# Altium project VESC_DEVICE.PrjPcb
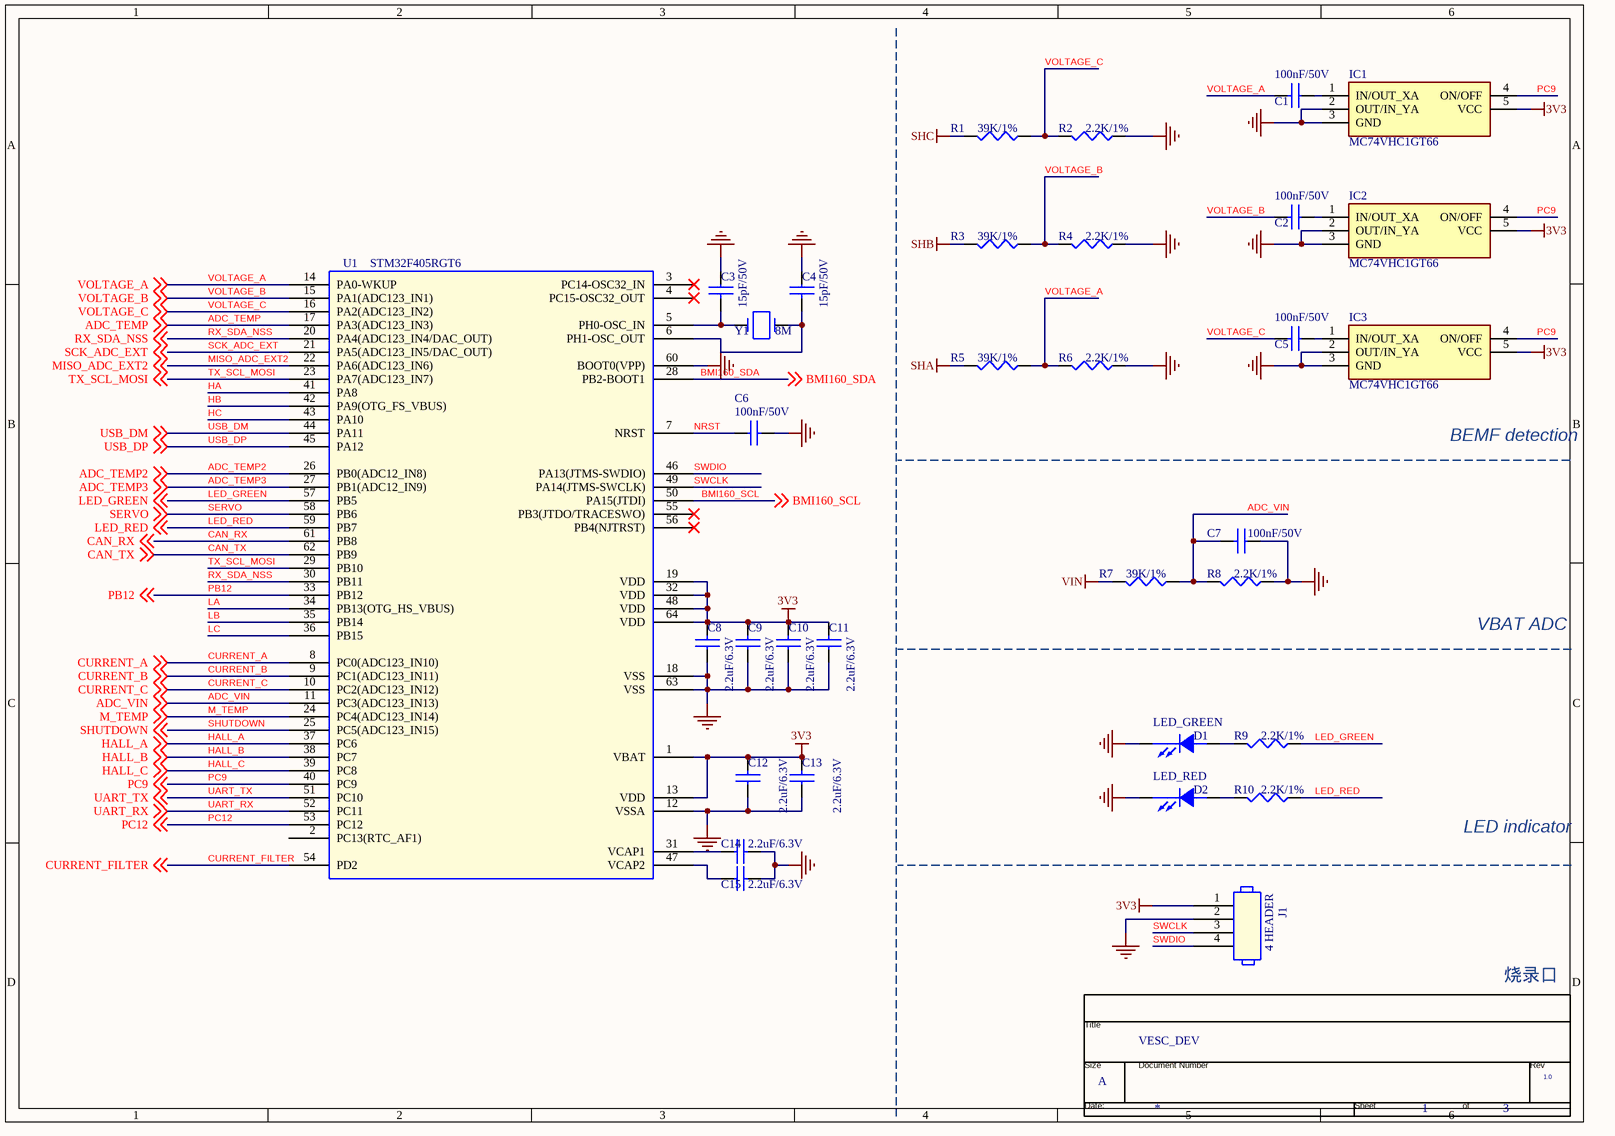
[diagram p0: MCU.SchDoc]
6 sheets, 198 parts. Net scope: global (net labels, ports and power ports of the same name join across sheets).
Board file: VESC_DEVICE.PcbDoc
Sheets:
  MCU.SchDoc
  Power.SchDoc
  BMI160.SchDoc
  NRF51822.SchDoc
  Gate_Drive.SchDoc
  Connector.SchDoc

## Sheet MCU.SchDoc
size 297 x 209 mm

### Parts
(Parts that share a designator on the sheet are numbered #1, #2 ... from top to bottom, then left to right.)
*#1  Page Count: 3  Page Number: 1  Page Size: A  Title: VESC_DEV  RevCode: 1.0  (hidden comment: TitleBlock0)  (graphical)
C1  100nF/50V  [C0402]
C2  100nF/50V  [C0402]
C3  15pF/50V  [C0402]
C4  15pF/50V  [C0402]
C5  100nF/50V  [C0402]
C6  100nF/50V  [C0402]
C7  100nF/50V  [C0402]
C8  2.2uF/6.3V  [C0402]
C9  2.2uF/6.3V  [C0402]
C10  2.2uF/6.3V  [C0402]
C11  2.2uF/6.3V  [C0402]
C12  2.2uF/6.3V  [C0402]
C13  2.2uF/6.3V  [C0402]
C14  2.2uF/6.3V  [C0402]
C15  2.2uF/6.3V  [C0402]
D1  LED_GREEN  [LED0603]
D2  LED_RED  [LED0603]
IC1  MC74VHC1GT66  [SOT95P275X110-5N]
IC2  MC74VHC1GT66  [SOT95P275X110-5N]
IC3  MC74VHC1GT66  [SOT95P275X110-5N]
J1  4 HEADER  [ISP-4P-2_54]
R1  39K/1%  [R0402]
R2  2.2K/1%  [R0402]
R3  39K/1%  [R0402]
R4  2.2K/1%  [R0402]
R5  39K/1%  [R0402]
R6  2.2K/1%  [R0402]
R7  39K/1%  [R0402]
R8  2.2K/1%  [R0402]
R9  2.2K/1%  [R0402]
R10  2.2K/1%  [R0402]
U1  STM32F405RGT6  [LQFP64_10X10_05P]
Y1  8M  [SMD5032-2P]

### Nets
3V3: C8.2 C9.2 C10.2 C11.2 C12.2 C13.2 IC1.5(VCC) IC2.5(VCC) IC3.5(VCC) J1.1 U1.1(VBAT) U1.13(VDD) U1.19(VDD) U1.32(VDD) U1.48(VDD) U1.64(VDD)
GND: C3.1 C4.1 C6.2 C7.1 C8.1 C9.1 C10.1 C11.1 C12.1 C13.1 C14.2 C15.2 D1.1(CATHODE) D2.1(CATHODE) IC1.2(OUT/IN_YA) IC1.3(GND) IC2.2(OUT/IN_YA) IC2.3(GND) IC3.2(OUT/IN_YA) IC3.3(GND) J1.2 R2.1 R4.1 R6.1 R8.1 U1.12(VSSA) U1.18(VSS) U1.60(BOOT0(VPP)) U1.63(VSS)
SHA: R5.2
SHB: R3.2
SHC: R1.2
VIN: R7.2
ADC_TEMP: U1.17(PA3(ADC123_IN3)) ; off-sheet ADC_TEMP
ADC_TEMP2: U1.26(PB0(ADC12_IN8)) ; off-sheet ADC_TEMP2
ADC_TEMP3: U1.27(PB1(ADC12_IN9)) ; off-sheet ADC_TEMP3
ADC_VIN: C7.2 R7.1 R8.2 U1.11(PC3(ADC123_IN13)) ; off-sheet ADC_VIN
BMI160_SCL: U1.50(PA15(JTDI)) ; off-sheet BMI160_SCL
BMI160_SDA: U1.28(PB2-BOOT1) ; off-sheet BMI160_SDA
CAN_RX: U1.61(PB8) ; off-sheet CAN_RX
CAN_TX: U1.62(PB9) ; off-sheet CAN_TX
CURRENT_A: U1.8(PC0(ADC123_IN10)) ; off-sheet CURRENT_A
CURRENT_B: U1.9(PC1(ADC123_IN11)) ; off-sheet CURRENT_B
CURRENT_C: U1.10(PC2(ADC123_IN12)) ; off-sheet CURRENT_C
CURRENT_FILTER: U1.54(PD2) ; off-sheet CURRENT_FILTER
HA: U1.41(PA8)
HALL_A: U1.37(PC6) ; off-sheet HALL_A
HALL_B: U1.38(PC7) ; off-sheet HALL_B
HALL_C: U1.39(PC8) ; off-sheet HALL_C
HB: U1.42(PA9(OTG_FS_VBUS))
HC: U1.43(PA10)
LA: U1.34(PB13(OTG_HS_VBUS))
LB: U1.35(PB14)
LC: U1.36(PB15)
LED_GREEN: R9.1 U1.57(PB5) ; off-sheet LED_GREEN
LED_RED: R10.1 U1.59(PB7) ; off-sheet LED_RED
M_TEMP: U1.24(PC4(ADC123_IN14)) ; off-sheet M_TEMP
MISO_ADC_EXT2: U1.22(PA6(ADC123_IN6)) ; off-sheet MISO_ADC_EXT2
NRST: C6.1 U1.7(NRST)
PB12: U1.33(PB12) ; off-sheet PB12
PC9: IC1.4(ON/OFF) IC2.4(ON/OFF) IC3.4(ON/OFF) U1.40(PC9) ; off-sheet PC9
PC12: U1.53(PC12) ; off-sheet PC12
RX_SDA_NSS: U1.20(PA4(ADC123_IN4/DAC_OUT)) U1.30(PB11) ; off-sheet RX_SDA_NSS
SCK_ADC_EXT: U1.21(PA5(ADC123_IN5/DAC_OUT)) ; off-sheet SCK_ADC_EXT
SERVO: U1.58(PB6) ; off-sheet SERVO
SHUTDOWN: U1.25(PC5(ADC123_IN15)) ; off-sheet SHUTDOWN
SWCLK: J1.3 U1.49(PA14(JTMS-SWCLK))
SWDIO: J1.4 U1.46(PA13(JTMS-SWDIO))
TX_SCL_MOSI: U1.23(PA7(ADC123_IN7)) U1.29(PB10) ; off-sheet TX_SCL_MOSI
UART_RX: U1.52(PC11) ; off-sheet UART_RX
UART_TX: U1.51(PC10) ; off-sheet UART_TX
USB_DM: U1.44(PA11) ; off-sheet USB_DM
USB_DP: U1.45(PA12) ; off-sheet USB_DP
VOLTAGE_A: C1.2 R5.1 R6.2 U1.14(PA0-WKUP) ; off-sheet VOLTAGE_A
VOLTAGE_B: C2.2 R3.1 R4.2 U1.15(PA1(ADC123_IN1)) ; off-sheet VOLTAGE_B
VOLTAGE_C: C5.2 R1.1 R2.2 U1.16(PA2(ADC123_IN2)) ; off-sheet VOLTAGE_C
NetC1_1: C1.1 IC1.1(IN/OUT_XA)
NetC2_1: C2.1 IC2.1(IN/OUT_XA)
NetC3_2: C3.2 U1.5(PH0-OSC_IN) Y1.2
NetC4_2: C4.2 U1.6(PH1-OSC_OUT) Y1.1
NetC5_1: C5.1 IC3.1(IN/OUT_XA)
NetC14_1: C14.1 U1.31(VCAP1)
NetC15_1: C15.1 U1.47(VCAP2)
NetD1_2: D1.2(ANODE) R9.2
NetD2_2: D2.2(ANODE) R10.2

Not connected (* = marked no-connect by the designer): U1 2(PC13(RTC_AF1)) 3(PC14-OSC32_IN)* 4(PC15-OSC32_OUT)* 55(PB3(JTDO/TRACESWO))* 56(PB4(NJTRST))*

### Notes on the sheet
- BEMF detection
- VBAT ADC
- LED indicator
- 烧录口
- (in symbol TitleBlock0) Title; Size; Document Number; Rev; Date:; Sheet; of

### Library data of the parts
C1-C15 = CAP NP: PCB Footprint: C0402
D1 D2 = LED: PCB Footprint: LED0603
IC1-IC3 = MC74VHC1GT66: Integrated Circuit; Manufacturer_Name: onsemi; Datasheet Link: https://pdf1.alldatasheet.com/datasheet-pdf/view/148919/ETL/MC74VHC1GT66.html; Height: 1.1mm; Manufacturer_Part_Number: MC74VHC1GT66; Mouser Part Number: N/A; Mouser Price/Stock: https://www.mouser.co.uk/ProductDetail/onsemi/MC74VHC1GT66?qs=YA77FY0Msbu77w80Y0DYXA%3D%3D
R1-R10 = RESISTOR: PCB Footprint: R0402
Y1 = CRYSTAL: PCB Footprint: SMD5032-2P
*#1 = TitleBlock0: Page Create Date: March  8, 1995; Page Modify Date: *
J1 = 4 HEADER: PCB Footprint: ISP-4P-2_54
U1 = STM32F405RGT6: PCB Footprint: LQFP64_10X10_05P

## Sheet Power.SchDoc
size A
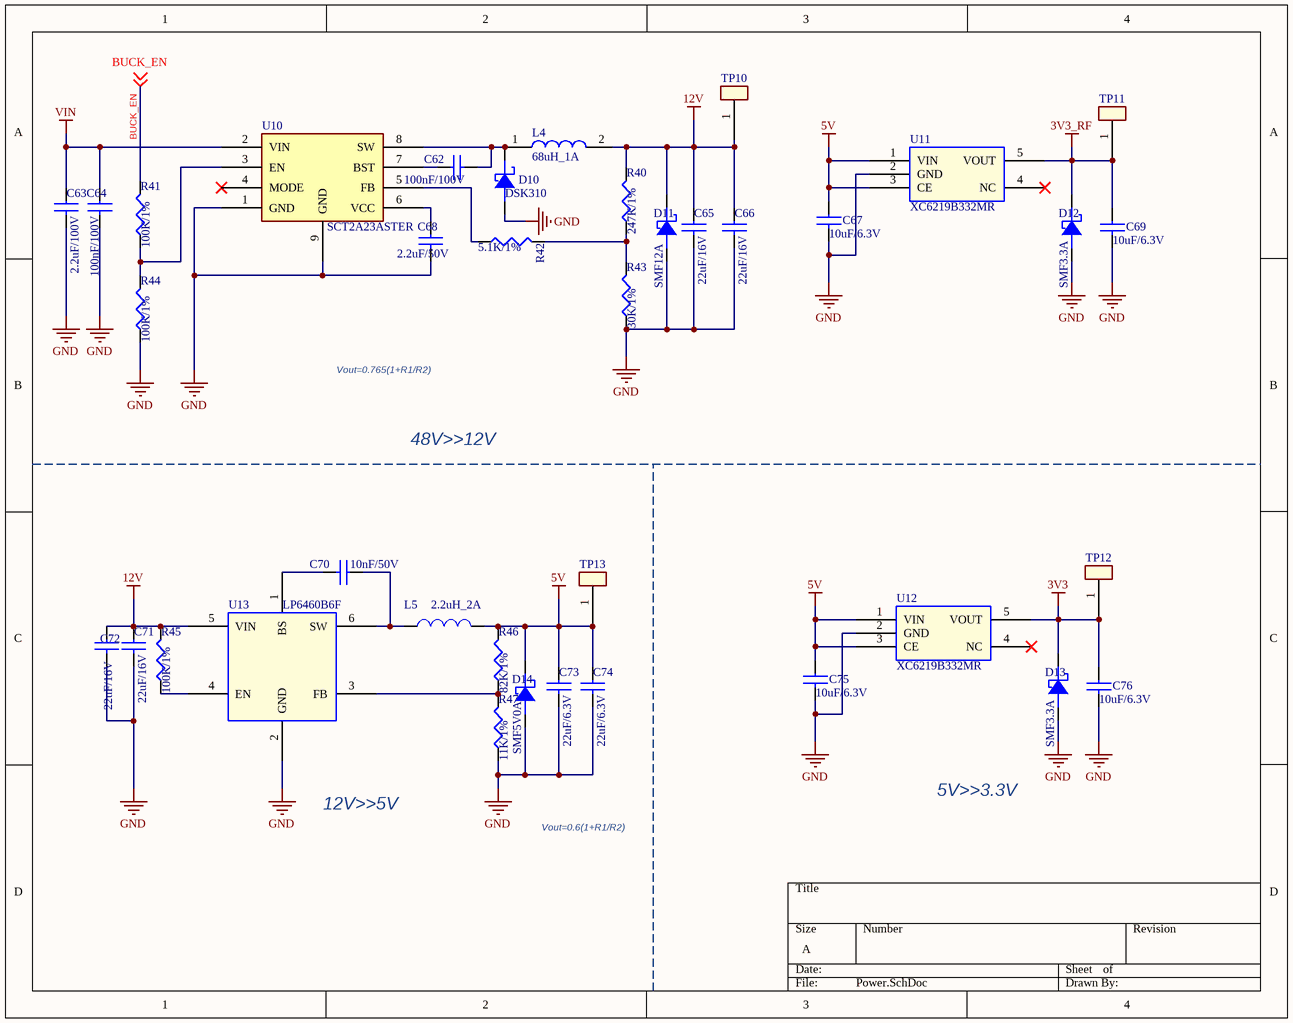
[diagram p1: Power.SchDoc]

### Parts
(Parts that share a designator on the sheet are numbered #1, #2 ... from top to bottom, then left to right.)
C62#1  100nF/100V  [C0603]
C63  2.2uF/100V  [C1206]
C64  100nF/100V  [C0603]
C65  22uF/16V  [C0805]
C66  22uF/16V  [C0805]
C67  10uF/6.3V  [C0402]
C68  2.2uF/50V  [C0603]
C69  10uF/6.3V  [C0402]
C70  10nF/50V  [C0402]
C71  22uF/16V  [C0805]
C72  22uF/16V  [C0805]
C73  22uF/6.3V  [C0805]
C74  22uF/6.3V  [C0805]
C75  10uF/6.3V  [C0402]
C76  10uF/6.3V  [C0402]
D10  DSK310  [SOD-123F]
D11  SMF12A  [SOD-123F]
D12  SMF3.3A  [SOD-123F]
D13  SMF3.3A  [SOD-123F]
D14  SMF5V0A  [SOD-123F]
L4  68uH_1A  [L5040]
L5  2.2uH_2A  [L4020]
R40  247K/1%  [R0402]
R41  100K/1%  [R0402]
R42  5.1K/1%  [R0402]
R43  30K/1%  [R0402]
R44  100K/1%  [R0402]
R45  100K/1%  [R0402]
R46  82K/1%  [R0402]
R47  11K/1%  [R0402]
TP10  TEST POINT  [test_point_100_smd]  (value not drawn)
TP11  TEST POINT  [test_point_100_smd]  (value not drawn)
TP12  TEST POINT  [test_point_100_smd]  (value not drawn)
TP13  TEST POINT  [test_point_100_smd]  (value not drawn)
U10  SCT2A23ASTER  [ESOP-8_L4.9-W3.9-P1.27-LS6.0-BL-EP]
U11  XC6219B332MR  [SOT-23-5]
U12  XC6219B332MR  [SOT-23-5]
U13  LP6460B6F  [SOT-23-6]

### Nets
3V3: C76.1 D13.1(K) TP12.1 U12.5(VOUT)
3V3_RF: C69.1 D12.1(K) TP11.1 U11.5(VOUT)
5V: C67.1 C73.1 C74.1 C75.1 D14.1(K) L5.2 R46.2 TP13.1 U11.1(VIN) U11.3(CE) U12.1(VIN) U12.3(CE)
12V: C65.1 C66.1 C71.1 C72.1 D11.1(K) L4.2 R40.2 R45.2 TP10.1 U13.5(VIN)
GND: C63.2 C64.2 C65.2 C66.2 C67.2 C68.2 C69.2 C71.2 C72.2 C73.2 C74.2 C75.2 C76.2 D10.2(A) D11.2(A) D12.2(A) D13.2(A) D14.2(A) R43.1 R44.1 R47.1 U10.1(GND) U10.9(GND) U11.2(GND) U12.2(GND) U13.2(GND)
VIN: C63.1 C64.1 U10.2(VIN)
BUCK_EN: R41.2 ; off-sheet BUCK_EN
NetC62#1_1: C62#1.1 U10.7(BST)
NetC62#1_2: C62#1.2 D10.1(K) L4.1 U10.8(SW)
NetC68_1: C68.1 U10.6(VCC)
NetC70_1: C70.1 L5.1 U13.6(SW)
NetC70_2: C70.2 U13.1(BS)
NetR40_1: R40.1 R42.2 R43.2
NetR41_1: R41.1 R44.2 U10.3(EN)
NetR42_1: R42.1 U10.5(FB)
NetR45_1: R45.1 U13.4(EN)
NetR46_1: R46.1 R47.2 U13.3(FB)

Not connected (* = marked no-connect by the designer): U10 4(MODE)*; U11 4(NC)*; U12 4(NC)*

### Notes on the sheet
- Vout=0.765(1+R1/R2)
- 48V>>12V
- 12V>>5V
- Vout=0.6(1+R1/R2)
- 5V>>3.3V

### Library data of the parts
C62#1 C63-C76 = CAP NP
  C62#1 C64 C68: PCB Footprint: C0603
  C63: PCB Footprint: C1206
  C65 C66 C71-C74: PCB Footprint: C0805
  C67 C69 C70 C75 C76: PCB Footprint: C0402
D10-D14 = DIODE SCHOTTKY21: PCB Footprint: SOD-123F
L4 = 74404054221: Inductor; Manufacturer_Name: Wurth Elektronik; Datasheet Link: https://www.mouser.com/datasheet/2/445/74404054221-1280555.pdf; Height: 4mm; Manufacturer_Part_Number: 74404054221; Mouser Part Number: 710-74404054221; Mouser Price/Stock: https://www.mouser.co.uk/ProductDetail/Wurth-Elektronik/74404054221?qs=f9yNj16SXrLBSuRgk86STQ%3D%3D
L5 = INDUCTOR: PCB Footprint: L4020
R40-R47 = RESISTOR: PCB Footprint: R0402
U10 = SCT2A23ASTER: Manufacturer: SCT(芯洲科技); Add into BOM: yes; Function: 降压型; Input Voltage: 4.5V~100V; Output Current: 1.2A; Switching Frequency: 300kHz; Number of Outputs: 1; Switch tube (built-in/external): 内置; Symbol: SCT2A23ASTER; Device: SCT2A23ASTER; LCSC Part Name: 宽输入范围1.2A降压DC-DC转换器; Supplier Part: C2901894; Manufacturer Part: SCT2A23ASTER; Supplier Footprint: ESOP-8; Datasheet: https://atta.szlcsc.com/upload/public/pdf/source/20211013/6F4F933FB08DD1E1458E8CCC6D5C6936.pdf; Supplier: LCSC; Convert to PCB: yes; Operating Temperature: -40℃~+125℃@(TJ)
U11 U12 = XC6219B332MR: PCB Footprint: SOT-23-5
U13 = LP6460B6F: PCB Footprint: SOT-23-6

## Sheet BMI160.SchDoc
size A
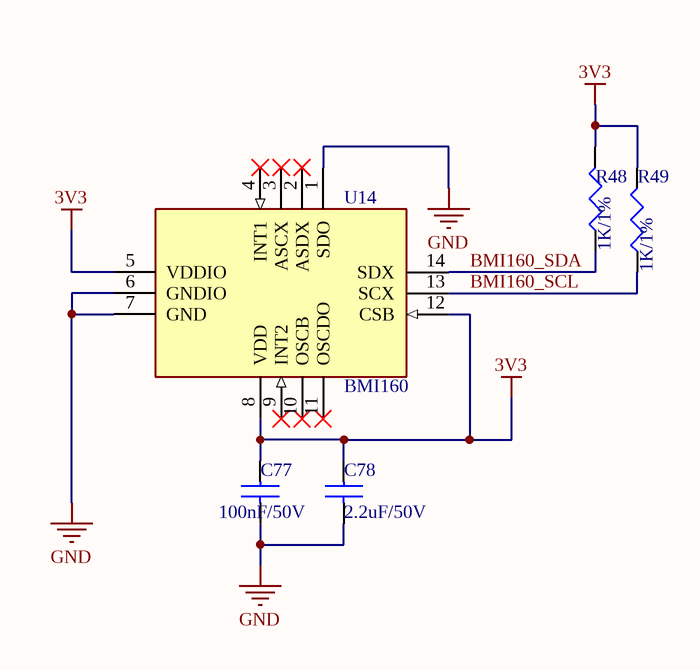
[diagram p2: BMI160.SchDoc]

### Parts
C77  100nF/50V  [C0402]
C78  2.2uF/50V  [C0402]
R48  1K/1%  [R0402]
R49  1K/1%  [R0402]
U14  BMI160  [PQFN50P300X250X88-14N]

### Nets
3V3: C77.1 C78.1 R48.2 R49.2 U14.5(VDDIO) U14.8(VDD) U14.12(CSB)
GND: C77.2 C78.2 U14.1(SDO) U14.6(GNDIO) U14.7(GND)
BMI160_SCL: R49.1 U14.13(SCX)
BMI160_SDA: R48.1 U14.14(SDX)

Not connected (* = marked no-connect by the designer): U14 2(ASDX)* 3(ASCX)* 4(INT1)* 9(INT2)* 10(OSCB)* 11(OSCDO)*

### Library data of the parts
C77 C78 = CAP NP: PCB Footprint: C0402
R48 R49 = RESISTOR: PCB Footprint: R0402
U14 = BMI160: Integrated Circuit; Manufacturer_Name: BOSCH; Datasheet Link: https://datasheet.datasheetarchive.com/originals/distributors/DKDS41/DSANUWW0031095.pdf; Height: 0.88mm; Manufacturer_Part_Number: BMI160; Mouser Part Number: 262-BMI160; Mouser Price/Stock: https://www.mouser.co.uk/ProductDetail/Bosch-Sensortec/BMI160?qs=Lj1LZLjqIN1DEsUDgjehlg%3D%3D; Arrow Part Number: BMI160; Arrow Price/Stock: https://www.arrow.com/en/products/bmi160/bosch?region=nac

## Sheet NRF51822.SchDoc
size A
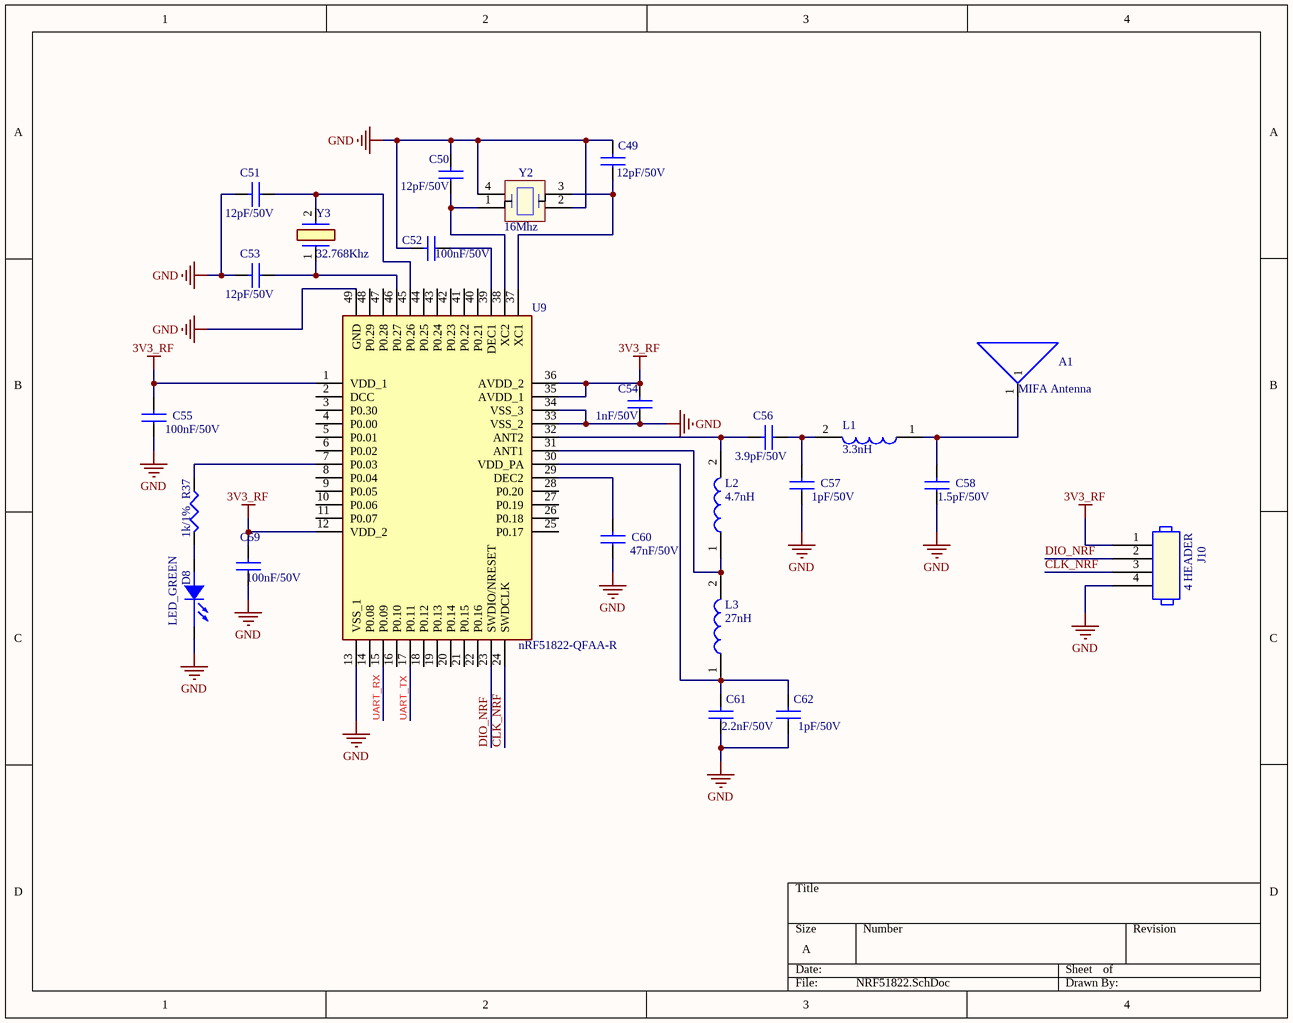
[diagram p3: NRF51822.SchDoc]

### Parts
(Parts that share a designator on the sheet are numbered #1, #2 ... from top to bottom, then left to right.)
A1  MIFA Antenna  [ANT-2.4GHZ-8.0X1.0MM]  (no BOM)
C49  12pF/50V  [C0402]
C50  12pF/50V  [C0402]
C51  12pF/50V  [C0402]
C52  100nF/50V  [C0402]
C53  12pF/50V  [C0402]
C54  1nF/50V  [C0402]
C55  100nF/50V  [C0402]
C56  3.9pF/50V  [C0402]
C57  1pF/50V  [C0402]
C58  1.5pF/50V  [C0402]
C59  100nF/50V  [C0402]
C60  47nF/50V  [C0402]
C61  2.2nF/50V  [C0402]
C62#2  1pF/50V  [C0402]
D8#1  LED_GREEN  [LED0603]
J10  4 HEADER  [ISP-4P-2_54]
L1  3.3nH  [LQG15WH0N7B02D]
L2  4.7nH  [LQG15WH0N7B02D]
L3  27nH  [LQG15WH0N7B02D]
R37#1  1k/1%  [R0402]
U9  nRF51822-QFAA-R  [QFN40P600X600X95-49N-D]
Y2  16Mhz  [Q22FA12800400]
Y3  32.768Khz  [ABS0532768KHZ9T]

### Nets
3V3_RF: C54.2 C55.2 C59.2 J10.1 U9.1(VDD_1) U9.12(VDD_2) U9.35(AVDD_1) U9.36(AVDD_2)
GND: C49.2 C50.2 C51.2 C52.2 C53.2 C54.1 C55.1 C57.1 C58.1 C59.1 C60.1 C61.1 C62#2.1 D8#1.1(CATHODE) J10.4 U9.13(VSS_1) U9.33(VSS_2) U9.34(VSS_3) U9.49(GND) Y2.2(GND_1) Y2.4(GND_2)
CLK_NRF: J10.3 U9.24(SWDCLK)
DIO_NRF: J10.2 U9.23(SWDIO/NRESET)
UART_RX: U9.15(P0.09)
UART_TX: U9.17(P0.11)
NetA1_1: A1.1 C58.2 L1.1
NetC49_1: C49.1 U9.37(XC1) Y2.3(CRYSTAL_2)
NetC50_1: C50.1 U9.38(XC2) Y2.1(CRYSTAL_1)
NetC51_1: C51.1 U9.45(P0.26) Y3.2
NetC52_1: C52.1 U9.39(DEC1)
NetC53_1: C53.1 U9.46(P0.27) Y3.1
NetC56_1: C56.1 C57.2 L1.2
NetC56_2: C56.2 L2.2 U9.32(ANT2)
NetC60_2: C60.2 U9.29(DEC2)
NetC61_2: C61.2 C62#2.2 L3.1 U9.30(VDD_PA)
NetD8#1_2: D8#1.2(ANODE) R37#1.1
NetL2_1: L2.1 L3.2 U9.31(ANT1)
NetR37#1_2: R37#1.2 U9.7(P0.03)

Not connected (* = marked no-connect by the designer): U9 2(DCC) 3(P0.30) 4(P0.00) 5(P0.01) 6(P0.02) 8(P0.04) 9(P0.05) 10(P0.06) 11(P0.07) 14(P0.08) 16(P0.10) 18(P0.12) 19(P0.13) 20(P0.14) 21(P0.15) 22(P0.16) 25(P0.17) 26(P0.18) 27(P0.19) 28(P0.20) 40(P0.21) 41(P0.22) 42(P0.23) 43(P0.24) 44(P0.25) 47(P0.28) 48(P0.29)

### Library data of the parts
A1 = Ceramic _ANTENNA: None; AMBIQ PN: PCB_ANTENNA
C49-C61 C62#2 = CAP NP: PCB Footprint: C0402
D8#1 = LED: PCB Footprint: LED0603
L1-L3 = LQG15HS4N7C02D: Inductor; Manufacturer_Name: Murata Electronics; Datasheet Link: https://search.murata.co.jp/Ceramy/image/img/P02/JELF243B-0010.pdf; Height: 0.6mm; Manufacturer_Part_Number: LQG15HS4N7C02D; Mouser Part Number: 81-LQG15HS4N7C02D; Mouser Price/Stock: https://www.mouser.co.uk/ProductDetail/Murata-Electronics/LQG15HS4N7C02D?qs=60uY6ySkanQsgm4t8ngjFA%3D%3D; Arrow Part Number: LQG15HS4N7C02D; Arrow Price/Stock: https://www.arrow.com/en/products/lqg15hs4n7c02d/murata-manufacturing
R37#1 = RESISTOR: PCB Footprint: R0402
U9 = nRF51822-QFAA-R: Integrated Circuit; Manufacturer_Name: Nordic Semiconductor; Datasheet Link: https://datasheet.datasheetarchive.com/originals/distributors/Datasheets-DGA5/435665.pdf; Height: 0.95mm; Manufacturer_Part_Number: nRF51822-QFAA-R; Mouser Part Number: 949-NRF51822-QFAA-R; Mouser Price/Stock: https://www.mouser.co.uk/ProductDetail/Nordic-Semiconductor/nRF51822-QFAA-R?qs=7xCC5jQa1OJP%2FZdtChopZw%3D%3D; Arrow Part Number: NRF51822-QFAA-R; Arrow Price/Stock: https://www.arrow.com/en/products/nrf51822-qfaa-r/nordic-semiconductor?utm_currency=USD&region=nac
Y2 = Q22FA12800400: Crystal or Oscillator; Manufacturer_Name: Seiko Epson Corporation; Datasheet Link: https://datasheet.lcsc.com/szlcsc/Seiko-Epson-Q22FA12800400_C255875.pdf; Height: 0.5mm; Manufacturer_Part_Number: Q22FA12800400
Y3 = ABS05-32.768KHZ-9-T: Crystal or Oscillator; Manufacturer_Name: ABRACON; Datasheet Link: https://abracon.com/Resonators/ABS05.pdf; Height: 0.5mm; Manufacturer_Part_Number: ABS05-32.768KHZ-9-T; Mouser Part Number: 815-ABS05-32.768K9T; Mouser Price/Stock: https://www.mouser.co.uk/ProductDetail/ABRACON/ABS05-32.768KHZ-9-T?qs=Pyu0ZBy%2FIJbsNYnIET1z3A%3D%3D; Arrow Part Number: ABS05-32.768KHZ-9-T; Arrow Price/Stock: https://www.arrow.com/en/products/abs05-32.768khz-9-t/abracon?region=nac
J10 = 4 HEADER: PCB Footprint: ISP-4P-2_54

## Sheet Gate_Drive.SchDoc
size A4
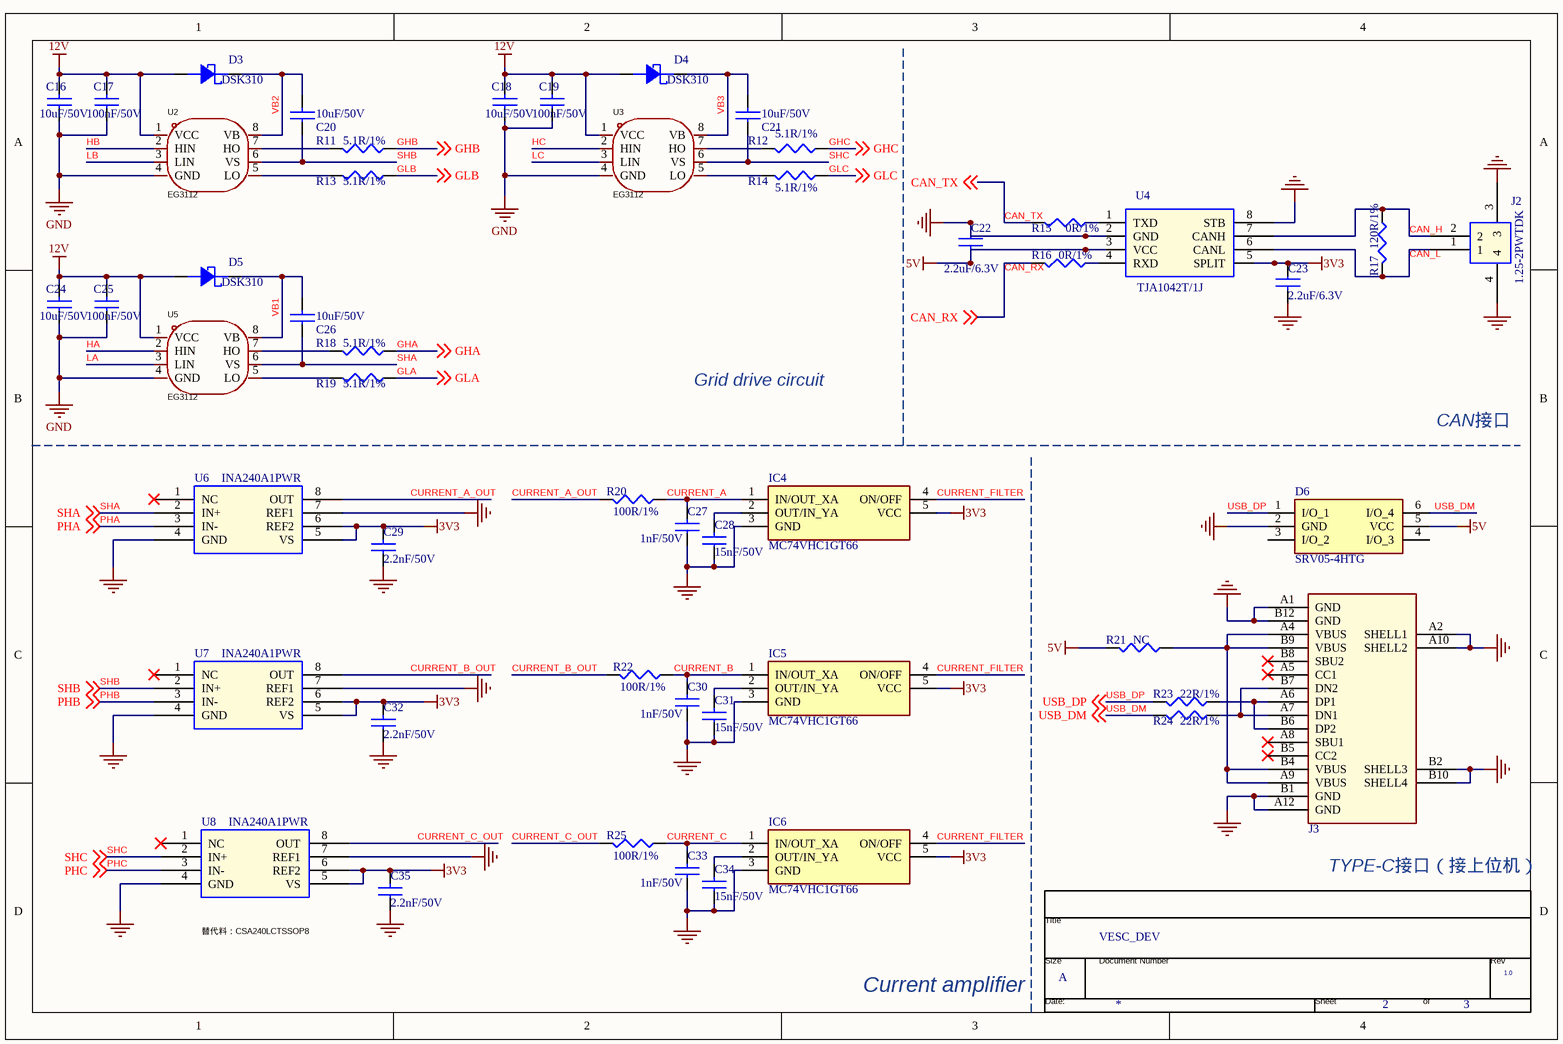
[diagram p4: Gate_Drive.SchDoc]

### Parts
(Parts that share a designator on the sheet are numbered #1, #2 ... from top to bottom, then left to right.)
*#2  Page Count: 3  Page Number: 2  Page Size: A  Title: VESC_DEV  RevCode: 1.0  (hidden comment: TitleBlock0)  (graphical)
C16  10uF/50V  [C0603]
C17  100nF/50V  [C0603]
C18  10uF/50V  [C0603]
C19  100nF/50V  [C0603]
C20  10uF/50V  [C0603]
C21  10uF/50V  [C0603]
C22  2.2uF/6.3V  [C0402]
C23  2.2uF/6.3V  [C0402]
C24  10uF/50V  [C0603]
C25  100nF/50V  [C0603]
C26  10uF/50V  [C0603]
C27  1nF/50V  [C0402]
C28  15nF/50V  [C0402]
C29  2.2nF/50V  [C0402]
C30  1nF/50V  [C0402]
C31  15nF/50V  [C0402]
C32  2.2nF/50V  [C0402]
C33  1nF/50V  [C0402]
C34  15nF/50V  [C0402]
C35  2.2nF/50V  [C0402]
D3  DSK310  [SOD-123F]
D4  DSK310  [SOD-123F]
D5  DSK310  [SOD-123F]
D6  SRV05-4HTG  [SOT95P280X145-6N]
IC4  MC74VHC1GT66  [SOT95P275X110-5N]
IC5  MC74VHC1GT66  [SOT95P275X110-5N]
IC6  MC74VHC1GT66  [SOT95P275X110-5N]
J2  1.25-2PWTDK  [SMD-2P-1_25]
J3  TYPE-C 16PLC-H10.0  [TYPE-C-TH_16PLC-H10.0]  (value not drawn)
R11  5.1R/1%  [R0603]
R12  5.1R/1%  [R0603]
R13  5.1R/1%  [R0603]
R14  5.1R/1%  [R0603]
R15  0R/1%  [R0402]
R16  0R/1%  [R0402]
R17  120R/1%  [R0402]
R18  5.1R/1%  [R0603]
R19  5.1R/1%  [R0603]
R20  100R/1%  [R0402]
R21  NC  [R0603]
R22  100R/1%  [R0402]
R23  22R/1%  [R0402]
R24  22R/1%  [R0402]
R25  100R/1%  [R0402]
U2  EG3112  [SOIC-8_L4.9-W3.9-P1.27-LS6.0-BL]
U3  EG3112  [SOIC-8_L4.9-W3.9-P1.27-LS6.0-BL]
U4  TJA1042T/1J  [SOP-8]
U5  EG3112  [SOIC-8_L4.9-W3.9-P1.27-LS6.0-BL]
U6  INA240A1PWR  [TSSOP-8]
U7  INA240A1PWR  [TSSOP-8]
U8  INA240A1PWR  [TSSOP-8]

### Nets
3V3: C23.1 C29.2 C32.2 C35.2 IC4.5(VCC) IC5.5(VCC) IC6.5(VCC) U4.5(SPLIT) U6.5(VS) U6.6(REF2) U7.5(VS) U7.6(REF2) U8.5(VS) U8.6(REF2)
5V: C22.2 D6.5(VCC) R21.2 U4.3(VCC)
12V: C16.2 C17.2 C18.2 C19.2 C24.2 C25.2 D3.2(A) D4.2(A) D5.2(A) U2.1(VCC) U3.1(VCC) U5.1(VCC)
GND: C16.1 C17.1 C18.1 C19.1 C22.1 C23.2 C24.1 C25.1 C27.1 C28.1 C29.1 C30.1 C31.1 C32.1 C33.1 C34.1 C35.1 D6.2(GND) IC4.3(GND) IC5.3(GND) IC6.3(GND) J2.3 J2.4 J3.A1(GND) J3.A2(SHELL1) J3.A10(SHELL2) J3.A12(GND) J3.B1(GND) J3.B2(SHELL3) J3.B10(SHELL4) J3.B12(GND) U2.4(GND) U3.4(GND) U4.2(GND) U4.8(STB) U5.4(GND) U6.4(GND) U6.7(REF1) U7.4(GND) U7.7(REF1) U8.4(GND) U8.7(REF1)
SHA: C26.1 U5.6(VS) U6.2(IN+) ; off-sheet SHA
SHB: C20.1 U2.6(VS) U7.2(IN+) ; off-sheet SHB
SHC: C21.1 U3.6(VS) U8.2(IN+) ; off-sheet SHC
CAN_H: J2.2 R17.1 U4.7(CANH)
CAN_L: J2.1 R17.2 U4.6(CANL)
CAN_RX: R16.2 ; off-sheet CAN_RX
CAN_TX: R15.2 ; off-sheet CAN_TX
CURRENT_A: C27.2 IC4.1(IN/OUT_XA) R20.1
CURRENT_A_OUT: R20.2 U6.8(OUT)
CURRENT_B: C30.2 IC5.1(IN/OUT_XA) R22.1
CURRENT_B_OUT: R22.2 U7.8(OUT)
CURRENT_C: C33.2 IC6.1(IN/OUT_XA) R25.1
CURRENT_C_OUT: R25.2 U8.8(OUT)
CURRENT_FILTER: IC4.4(ON/OFF) IC5.4(ON/OFF) IC6.4(ON/OFF)
GHA: R18.1 ; off-sheet GHA
GHB: R11.1 ; off-sheet GHB
GHC: R12.1 ; off-sheet GHC
GLA: R19.1 ; off-sheet GLA
GLB: R13.1 ; off-sheet GLB
GLC: R14.1 ; off-sheet GLC
HA: U5.2(HIN)
HB: U2.2(HIN)
HC: U3.2(HIN)
LA: U5.3(LIN)
LB: U2.3(LIN)
LC: U3.3(LIN)
PHA: U6.3(IN-) ; off-sheet PHA
PHB: U7.3(IN-) ; off-sheet PHB
PHC: U8.3(IN-) ; off-sheet PHC
USB_DM: D6.6(I/O_4) R24.2 ; off-sheet USB_DM
USB_DP: D6.1(I/O_1) R23.2 ; off-sheet USB_DP
VB1: C26.2 D5.1(K) U5.8(VB)
VB2: C20.2 D3.1(K) U2.8(VB)
VB3: C21.2 D4.1(K) U3.8(VB)
NetC28_2: C28.2 IC4.2(OUT/IN_YA)
NetC31_2: C31.2 IC5.2(OUT/IN_YA)
NetC34_2: C34.2 IC6.2(OUT/IN_YA)
NetJ3_A4: J3.A4(VBUS) J3.A9(VBUS) J3.B4(VBUS) J3.B9(VBUS) R21.1
NetJ3_A6: J3.A6(DP1) J3.B6(DP2) R23.1
NetJ3_A7: J3.A7(DN1) J3.B7(DN2) R24.1
NetR11_2: R11.2 U2.7(HO)
NetR12_2: R12.2 U3.7(HO)
NetR13_2: R13.2 U2.5(LO)
NetR14_2: R14.2 U3.5(LO)
NetR15_1: R15.1 U4.1(TXD)
NetR16_1: R16.1 U4.4(RXD)
NetR18_2: R18.2 U5.7(HO)
NetR19_2: R19.2 U5.5(LO)

Not connected (* = marked no-connect by the designer): D6 3(I/O_2) 4(I/O_3); J3 A5(CC1)* A8(SBU1)* B5(CC2)* B8(SBU2)*; U6 1(NC)*; U7 1(NC)*; U8 1(NC)*

### Notes on the sheet
- Grid drive circuit
- CAN接口
- (near U8) 替代料：CSA240LCTSSOP8
- (near J3) TYPE-C接口（接上位机）
- Current amplifier
- (in symbol TitleBlock0) Title; Size; Document Number; Rev; Date:; Sheet; of

### Library data of the parts
C16-C35 = CAP NP
  C16-C21 C24-C26: PCB Footprint: C0603
  C22 C23 C27-C35: PCB Footprint: C0402
D3-D5 = DIODE SCHOTTKY21: PCB Footprint: SOD-123F
D6 = SRV05-4HTG: TVS Diode (Uni-directional); Manufacturer_Name: LITTELFUSE; Datasheet Link: https://componentsearchengine.com/Datasheets/2/SRV05-4HTG.pdf; Height: 1.45mm; Manufacturer_Part_Number: SRV05-4HTG; Mouser Part Number: 576-SRV05-4HTG; Mouser Price/Stock: https://www.mouser.co.uk/ProductDetail/Littelfuse/SRV05-4HTG?qs=TI15CVqcli3Liexbf3C%2FVA%3D%3D; Arrow Part Number: SRV05-4HTG; Arrow Price/Stock: https://www.arrow.com/en/products/srv05-4htg/littelfuse?region=nac
IC4-IC6 = MC74VHC1GT66: as IC1 on sheet MCU; Datasheet Link: https://pdf1.alldatasheet.com/datasheet-pdf/view/148919/ETL/MC74VHC1GT66.html; Height: 1.1mm; Manufacturer_Part_Number: MC74VHC1GT66; Mouser Part Number: N/A; Mouser Price/Stock: https://www.mouser.co.uk/ProductDetail/onsemi/MC74VHC1GT66?qs=YA77FY0Msbu77w80Y0DYXA%3D%3D
J3 = TYPE-C 16PLC-H10.0: 连接器类型:Type-C;标准:USB 3.1;公母:母;安装方式:直插;触点数量:16P;端口数量:1;额定电流 - 电源:5A;触头材质:-;触头镀层:-;工作温度范围:-40℃~+85℃;; Manufacturer: SHOU HAN(首韩); Add into BOM: yes; Gender: 母; Number of Contacts: 16P; Number of Ports: 1; Current Rating - Power (Max): 5A; Rated Voltage (Max): 20V; Connect-Disconnect Life: 1万次; Core Colour: 黑色; Symbol: TYPE-C 16PLC-H10.0; Device: TYPE-C 16PLC-H10.0; LCSC Part Name: Type-C 母 直插; Supplier Part: C3151747; Manufacturer Part: TYPE-C 16PLC-H10.0; Supplier Footprint: 插件; Datasheet: https://atta.szlcsc.com/upload/public/pdf/source/20240529/CC9428849977884A813B584EA396EFE9.pdf; Supplier: LCSC; Convert to PCB: yes; Connector Type: Type-C; Standard: USB 3.1; Mounting Style: 直插; Contact Material: -; Contact Plating: -; Operating Temperature Range: -40℃~+85℃
R11-R14 R18 R19 = RESISTOR: PCB Footprint: R0402
R15-R17 R20-R25 = RESISTOR
  R15-R17 R20 R22-R25: PCB Footprint: R0402
  R21: PCB Footprint: R0603
U2 U3 U5 = EG3112: Manufacturer: EG(屹晶微); Add into BOM: yes; Symbol: EG3112; Device: EG3112; LCSC Part Name: EG3112; Supplier Part: C111908; Manufacturer Part: EG3112; Supplier Footprint: SOIC-8; JLCPCB Part Class: Extended Part; Datasheet: https://atta.szlcsc.com/upload/public/pdf/source/20230725/3992D5BD05E91E0CBB5D3EE72F4B3B26.pdf; Supplier: LCSC; Convert to PCB: yes
*#2 = TitleBlock0: Page Create Date: March  8, 1995; Page Modify Date: *
J2 = 1.25-2PWTDK: PCB Footprint: SMD-2P-1_25
U4 = TJA1042T/1J: PCB Footprint: SOP-8
U6-U8 = INA240A1PWR: PCB Footprint: TSSOP-8

## Sheet Connector.SchDoc
size 246 x 182 mm
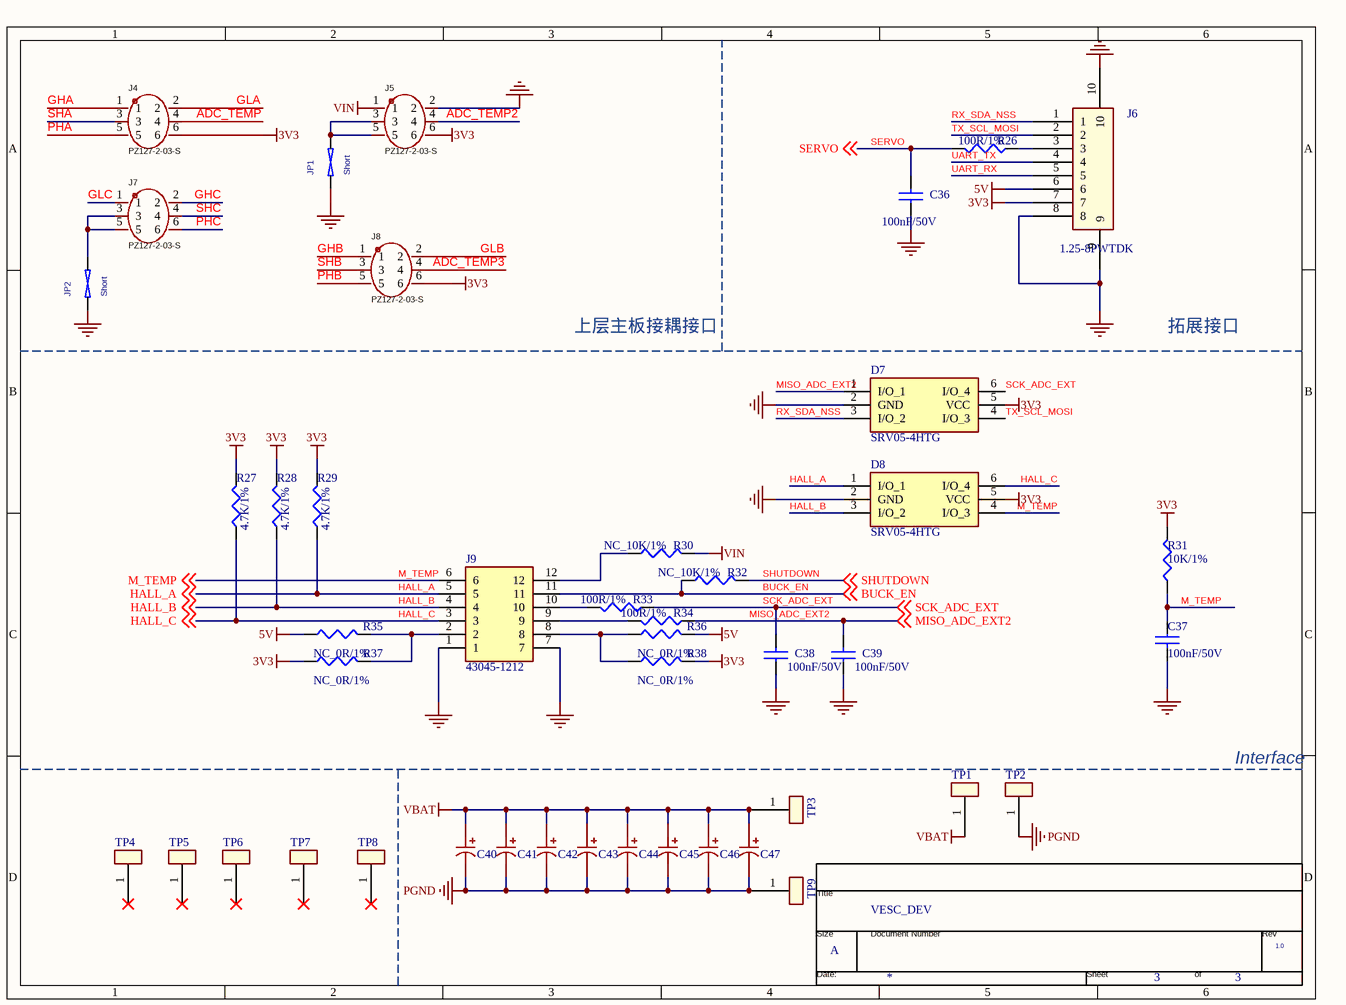
[diagram p5: Connector.SchDoc]

### Parts
(Parts that share a designator on the sheet are numbered #1, #2 ... from top to bottom, then left to right.)
*#3  Page Count: 3  Page Size: A  Title: VESC_DEV  RevCode: 1.0  (hidden comment: TitleBlock0)  (graphical)
C36  100nF/50V  [C0402]
C37  100nF/50V  [C0402]
C38  100nF/50V  [C0402]
C39  100nF/50V  [C0402]
C40  680uF  [CAP-TH_BD10.0-P5.00-D0.6-FD]  (value not drawn)
C41  680uF  [CAP-TH_BD10.0-P5.00-D0.6-FD]  (value not drawn)
C42  680uF  [CAP-TH_BD10.0-P5.00-D0.6-FD]  (value not drawn)
C43  680uF  [CAP-TH_BD10.0-P5.00-D0.6-FD]  (value not drawn)
C44  680uF  [CAP-TH_BD10.0-P5.00-D0.6-FD]  (value not drawn)
C45  680uF  [CAP-TH_BD10.0-P5.00-D0.6-FD]  (value not drawn)
C46  680uF  [CAP-TH_BD10.0-P5.00-D0.6-FD]  (value not drawn)
C47  680uF  [CAP-TH_BD10.0-P5.00-D0.6-FD]  (value not drawn)
D7  SRV05-4HTG  [SOT95P280X145-6N]
D8#2  SRV05-4HTG  [SOT95P280X145-6N]
J4  PZ127-2-03-S  [HDR-SMD_6P-P1.27-V-M-R2-C3-LS5.3]
J5  PZ127-2-03-S  [HDR-SMD_6P-P1.27-V-M-R2-C3-LS5.3]
J6  1.25-8PWTDK  [SMD-8P-1_25]
J7  PZ127-2-03-S  [HDR-SMD_6P-P1.27-V-M-R2-C3-LS5.3]
J8  PZ127-2-03-S  [HDR-SMD_6P-P1.27-V-M-R2-C3-LS5.3]
J9  43045-1212  [43045-12YY_121314]
JP1  Short  [SHORT]
JP2  Short  [SHORT]
R26  100R/1%  [R0402]
R27  4.7K/1%  [R0402]
R28  4.7K/1%  [R0402]
R29  4.7K/1%  [R0402]
R30  NC_10K/1%  [R0402]
R31  10K/1%  [R0402]
R32  NC_10K/1%  [R0402]
R33  100R/1%  [R0402]
R34  100R/1%  [R0402]
R35  NC_0R/1%  [R0402]
R36  NC_0R/1%  [R0402]
R37#2  NC_0R/1%  [R0402]
R38  NC_0R/1%  [R0402]
TP1  TEST POINT  [HOLE-4MM_M]  (value not drawn)
TP2  TEST POINT  [HOLE-4MM_M]  (value not drawn)
TP3  TEST POINT  [HOLE-8MM_M]  (value not drawn)
TP4  TEST POINT  [HOLE-4MM_M]  (value not drawn)
TP5  TEST POINT  [HOLE-4MM_M]  (value not drawn)
TP6  TEST POINT  [HOLE-8MM_M]  (value not drawn)
TP7  TEST POINT  [HOLE-8MM_M]  (value not drawn)
TP8  TEST POINT  [HOLE-8MM_M]  (value not drawn)
TP9  TEST POINT  [HOLE-8MM_M]  (value not drawn)

### Nets
3V3: D7.5(VCC) D8#2.5(VCC) J4.6 J5.6 J6.7 J8.6 R27.2 R28.2 R29.2 R31.2 R37#2.2 R38.1
5V: J6.6 R35.2 R36.1
GND: C36.1 C37.2 C38.1 C39.1 D7.2(GND) D8#2.2(GND) J5.2 J6.8 J6.9 J6.10 J9.1 J9.7 JP1.1 JP2.1
PGND: C40.2 C41.2 C42.2 C43.2 C44.2 C45.2 C46.2 C47.2 TP2.1 TP9.1
SHA: J4.3
SHB: J8.3
SHC: J7.4
VBAT: C40.1 C41.1 C42.1 C43.1 C44.1 C45.1 C46.1 C47.1 TP1.1 TP3.1
VIN: J5.1 R30.1
ADC_TEMP: J4.4
ADC_TEMP2: J5.4
ADC_TEMP3: J8.4
BUCK_EN: J9.11 R32.2 ; off-sheet BUCK_EN
GHA: J4.1
GHB: J8.1
GHC: J7.2
GLA: J4.2
GLB: J8.2
GLC: J7.1
HALL_A: D8#2.1(I/O_1) J9.5 R29.1 ; off-sheet HALL_A
HALL_B: D8#2.3(I/O_2) J9.4 R28.1 ; off-sheet HALL_B
HALL_C: D8#2.6(I/O_4) J9.3 R27.1 ; off-sheet HALL_C
M_TEMP: C37.1 D8#2.4(I/O_3) J9.6 R31.1 ; off-sheet M_TEMP
MISO_ADC_EXT2: C39.2 D7.1(I/O_1) R34.2 ; off-sheet MISO_ADC_EXT2
PHA: J4.5
PHB: J8.5
PHC: J7.6
RX_SDA_NSS: D7.3(I/O_2) J6.1
SCK_ADC_EXT: C38.2 D7.6(I/O_4) R33.2 ; off-sheet SCK_ADC_EXT
SERVO: C36.2 R26.1 ; off-sheet SERVO
SHUTDOWN: R32.1 ; off-sheet SHUTDOWN
TX_SCL_MOSI: D7.4(I/O_3) J6.2
UART_RX: J6.5
UART_TX: J6.4
NetJ5_3: J5.3 J5.5 JP1.2
NetJ6_3: J6.3 R26.2
NetJ7_3: J7.3 J7.5 JP2.2
NetJ9_2: J9.2 R35.1 R37#2.1
NetJ9_8: J9.8 R36.2 R38.2
NetJ9_9: J9.9 R34.1
NetJ9_10: J9.10 R33.1
NetJ9_12: J9.12 R30.2

Not connected (* = marked no-connect by the designer): TP4 1*; TP5 1*; TP6 1*; TP7 1*; TP8 1*

### Notes on the sheet
- 上层主板接耦接口
- 拓展接口
- Interface
- (in symbol TitleBlock0) Title; Size; Document Number; Rev; Date:; Sheet; of

### Library data of the parts
C36-C39 = CAP NP: PCB Footprint: C0402
C40-C47 = ERS1VM681G16OT: 容值:680uF;精度:±20%;额定电压:35V;纹波电流:-;等效串联电阻:-;; Manufacturer: AISHI(艾华集团); Add into BOM: yes; Tolerance: ±20%; Rated Voltage: 35V; Symbol: ERS1VM681G16OT; Device: ERS1VM681G16OT; LCSC Part Name: 680uF ±20% 35V; Supplier Part: C721283; Manufacturer Part: ERS1VM681G16OT; Supplier Footprint: 插件,D10xL16mm; Datasheet: https://atta.szlcsc.com/upload/public/pdf/source/20191015/C438940_4B8E60A742BB0AE40DDEF87A5C89089D.pdf; Supplier: LCSC; Convert to PCB: yes; Value: 680uF; Ripple Current: -; Equivalent Series Resistance(ESR): -; Lead Spacing: -; φD: -; L: -; Lifetime @ Temp: -
D7 D8#2 = SRV05-4HTG: as D6 on sheet Gate_Drive; Datasheet Link: https://componentsearchengine.com/Datasheets/2/SRV05-4HTG.pdf; Height: 1.45mm; Manufacturer_Part_Number: SRV05-4HTG; Mouser Part Number: 576-SRV05-4HTG; Mouser Price/Stock: https://www.mouser.co.uk/ProductDetail/Littelfuse/SRV05-4HTG?qs=TI15CVqcli3Liexbf3C%2FVA%3D%3D; Arrow Part Number: SRV05-4HTG; Arrow Price/Stock: https://www.arrow.com/en/products/srv05-4htg/littelfuse?region=nac
J4 J5 J7 J8 = PZ127-2-03-S: Manufacturer: HCTL(华灿天禄); Add into BOM: yes; Pin Structure: 2x3P; Pitch: 1.27mm; Circluar Pins/Square Pins: 方针; Current Rating (Max): 1A; Soldering Temperature(Max): 260℃@10S; Symbol: PZ127-2-03-S; Device: PZ127-2-03-S; LCSC Part Name: 2x3P 间距:1.27mm 方针 立贴; Supplier Part: C3975186; Manufacturer Part: PZ127-2-03-S; Supplier Footprint: SMD,P=1.27mm; JLCPCB Part Class: Extended Part; Datasheet: https://atta.szlcsc.com/upload/public/pdf/source/20230609/2ACB07ADC7D4DAF6D292F3D23C037F6C.pdf; Supplier: LCSC; Convert to PCB: yes; Row Spacing: 1.27mm; Mounting Type: 立贴; Number of Rows: 双排; Number of Pins: 6P; Length of Mating Pin: 4mm; Insulation Height: 1.5mm; Length of End Connection Pin: -; Contact Material: 黄铜; Operating Temperature Range: -40℃~+105℃; Color: 黑色
J9 = 43045-1212: Connector; Manufacturer_Name: Molex; Datasheet Link: https://www.molex.com/pdm_docs/sd/430450612_sd.pdf; Height: 9.91mm; Manufacturer_Part_Number: 43045-1212; Mouser Part Number: 538-43045-1212; Mouser Price/Stock: https://www.mouser.co.uk/ProductDetail/Molex/43045-1212?qs=359VwiUTsp27ERpkj8aHfQ%3D%3D
JP1 JP2 = SHORT: 2 PIN SHORTED TO CONNECT DIFFERENT NETS; PART_NUMBER: TMP-442; CLASS: DISCRETE
R26-R36 R37#2 R38 = RESISTOR: PCB Footprint: R0402
*#3 = TitleBlock0: Page Number: 3; Page Create Date: March  8, 1995; Page Modify Date: *

## Nets that join several sheets
3V3: MCU (16 pins), Power (C76.1 D13.1 TP12.1 U12.5), BMI160 (7 pins), Gate_Drive (14 pins), Connector (12 pins)
3V3_RF: Power (C69.1 D12.1 TP11.1 U11.5), NRF51822 (8 pins)
5V: Power (12 pins), Gate_Drive (C22.2 D6.5 R21.2 U4.3), Connector (J6.6 R35.2 R36.1)
12V: Power (10 pins), Gate_Drive (12 pins)
GND: MCU (29 pins), Power (26 pins), BMI160 (5 pins), NRF51822 (21 pins), Gate_Drive (42 pins), Connector (14 pins)
SHA: MCU (R5.2), Gate_Drive (C26.1 U5.6 U6.2), Connector (J4.3)
SHB: MCU (R3.2), Gate_Drive (C20.1 U2.6 U7.2), Connector (J8.3)
SHC: MCU (R1.2), Gate_Drive (C21.1 U3.6 U8.2), Connector (J7.4)
VIN: MCU (R7.2), Power (C63.1 C64.1 U10.2), Connector (J5.1 R30.1)
ADC_TEMP: MCU (U1.17), Connector (J4.4)
ADC_TEMP2: MCU (U1.26), Connector (J5.4)
ADC_TEMP3: MCU (U1.27), Connector (J8.4)
BMI160_SCL: MCU (U1.50), BMI160 (R49.1 U14.13)
BMI160_SDA: MCU (U1.28), BMI160 (R48.1 U14.14)
BUCK_EN: Power (R41.2), Connector (J9.11 R32.2)
CAN_RX: MCU (U1.61), Gate_Drive (R16.2)
CAN_TX: MCU (U1.62), Gate_Drive (R15.2)
CURRENT_A: MCU (U1.8), Gate_Drive (C27.2 IC4.1 R20.1)
CURRENT_B: MCU (U1.9), Gate_Drive (C30.2 IC5.1 R22.1)
CURRENT_C: MCU (U1.10), Gate_Drive (C33.2 IC6.1 R25.1)
CURRENT_FILTER: MCU (U1.54), Gate_Drive (IC4.4 IC5.4 IC6.4)
GHA: Gate_Drive (R18.1), Connector (J4.1)
GHB: Gate_Drive (R11.1), Connector (J8.1)
GHC: Gate_Drive (R12.1), Connector (J7.2)
GLA: Gate_Drive (R19.1), Connector (J4.2)
GLB: Gate_Drive (R13.1), Connector (J8.2)
GLC: Gate_Drive (R14.1), Connector (J7.1)
HA: MCU (U1.41), Gate_Drive (U5.2)
HALL_A: MCU (U1.37), Connector (D8#2.1 J9.5 R29.1)
HALL_B: MCU (U1.38), Connector (D8#2.3 J9.4 R28.1)
HALL_C: MCU (U1.39), Connector (D8#2.6 J9.3 R27.1)
HB: MCU (U1.42), Gate_Drive (U2.2)
HC: MCU (U1.43), Gate_Drive (U3.2)
LA: MCU (U1.34), Gate_Drive (U5.3)
LB: MCU (U1.35), Gate_Drive (U2.3)
LC: MCU (U1.36), Gate_Drive (U3.3)
M_TEMP: MCU (U1.24), Connector (C37.1 D8#2.4 J9.6 R31.1)
MISO_ADC_EXT2: MCU (U1.22), Connector (C39.2 D7.1 R34.2)
PHA: Gate_Drive (U6.3), Connector (J4.5)
PHB: Gate_Drive (U7.3), Connector (J8.5)
PHC: Gate_Drive (U8.3), Connector (J7.6)
RX_SDA_NSS: MCU (U1.20 U1.30), Connector (D7.3 J6.1)
SCK_ADC_EXT: MCU (U1.21), Connector (C38.2 D7.6 R33.2)
SERVO: MCU (U1.58), Connector (C36.2 R26.1)
SHUTDOWN: MCU (U1.25), Connector (R32.1)
TX_SCL_MOSI: MCU (U1.23 U1.29), Connector (D7.4 J6.2)
UART_RX: MCU (U1.52), NRF51822 (U9.15), Connector (J6.5)
UART_TX: MCU (U1.51), NRF51822 (U9.17), Connector (J6.4)
USB_DM: MCU (U1.44), Gate_Drive (D6.6 R24.2)
USB_DP: MCU (U1.45), Gate_Drive (D6.1 R23.2)